# EAGLE design PCB_MAIN (EAGLE 9.1.2)

## Sheet 1 of 2
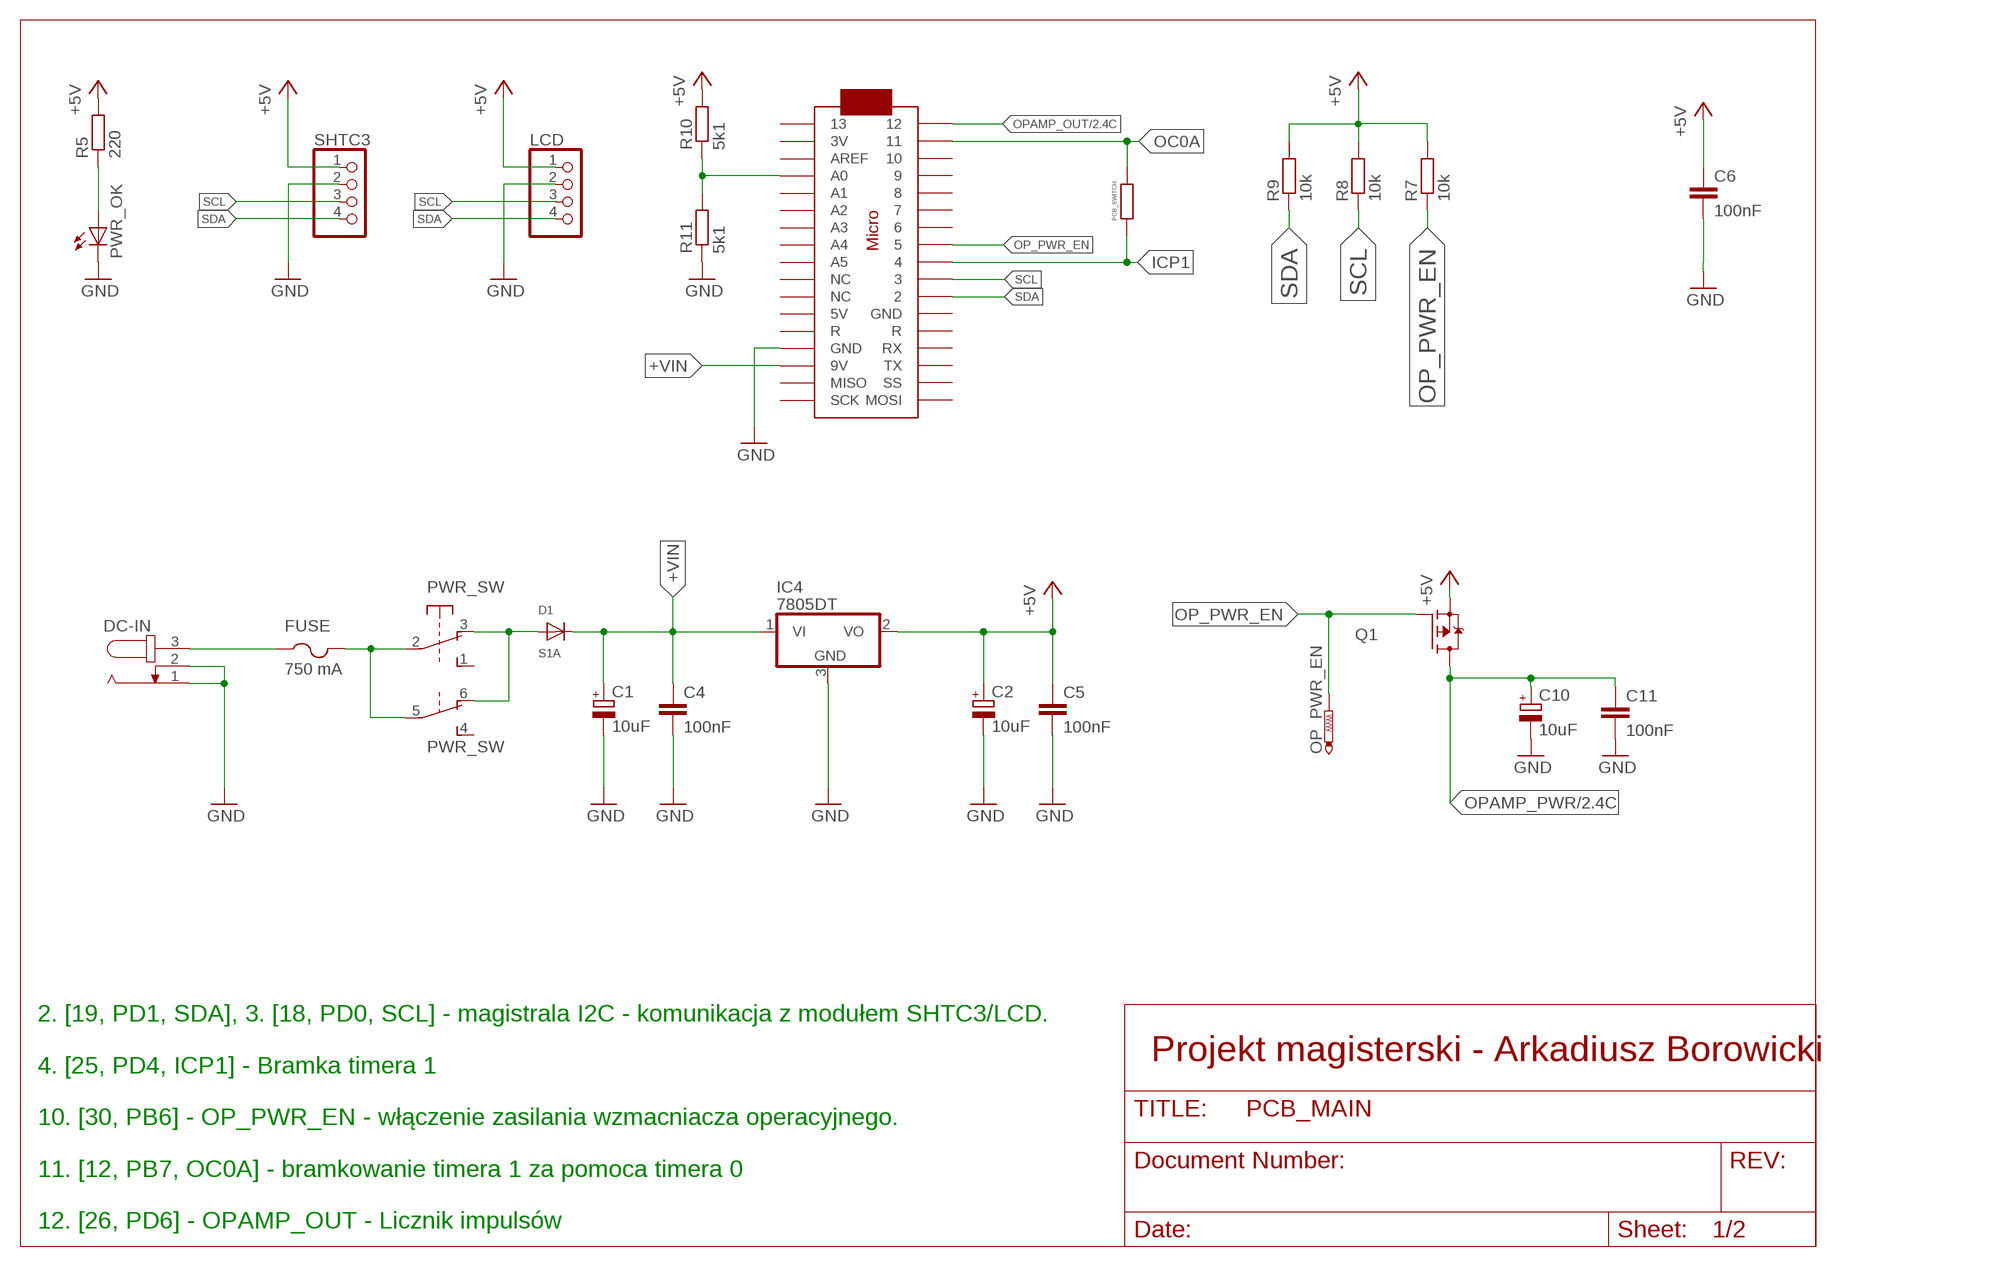
[diagram p0: schematic, sheet 1]

### Parts
C1  10uF  CPOL-EU153CLV-0605  [153CLV-0605]
C2  10uF  CPOL-EU153CLV-0605  [153CLV-0605]
C4  100nF  C-EUC1206K  [C1206K]
C5  100nF  C-EUC1206K  [C1206K]
C6  100nF  C-EUC1206K  [C1206K]
C10  10uF  CPOL-EU153CLV-0605  [153CLV-0605]
C11  100nF  C-EUC1206K  [C1206K]
D1  S1A  DIODESMA  [SMADIODE]
DC-IN  JACK-PLUG1  [SPC4078]
FUSE  750 mA  PTCFUSE-1812  [1812]
IC4  7805DT  [TO252]
LCD  PINHD-1X4  [1X04]
OP_PWR_EN  PTR1TP20R  [TP20R]
PCB_SWITCH  R-EU_R0402  [R0402]
PWR_OK  LEDSMT1206  [1206]
PWR_SW  9077-2  [9077-2]
Q1  SPD30P06PTO252  [TO252]
R5  220  R-EU_R1206  [R1206]
R7  10k  R-EU_R1206  [R1206]
R8  10k  R-EU_R1206  [R1206]
R9  10k  R-EU_R1206  [R1206]
R10  5k1  R-EU_R1206  [R1206]
R11  5k1  R-EU_R1206  [R1206]
SHTC3  PINHD-1X4  [1X04]
U$1  ARDUINOMICRO  [ARDUINOMICRO]

### Nets
+5V: C2.+ C5.1 C6.1 IC4.2(VO) LCD.1 Q1.2(S) R5.2 R7.2 R8.2 R9.2 R10.2 SHTC3.1 ; also sheet 2
+VIN: C1.+ C4.1 D1.C IC4.1(VI) U$1.P$20(9V)
GND: C1.- C2.- C4.2 C5.2 C6.2 C10.- C11.2 DC-IN.1 DC-IN.2 IC4.3(GND) LCD.2 PWR_OK.C R11.1 SHTC3.2 U$1.P$12(GND) ; also sheet 2
ICP1: PCB_SWITCH.1 U$1.P$9
N$3: R10.1 R11.2 U$1.P$31(A0)
N$4: DC-IN.3 FUSE.1
N$5: PWR_OK.A R5.1
N$6: D1.A PWR_SW.3(1:O) PWR_SW.6(2:O)
N$8: FUSE.2 PWR_SW.2(1:P) PWR_SW.5(2:P)
OC0A: PCB_SWITCH.2 U$1.P$2
OP_PWR_EN: OP_PWR_EN.TP Q1.1(G) R7.1 U$1.P$8
OPAMP_OUT: U$1.P$1 ; also sheet 2
OPAMP_PWR: C10.+ C11.1 Q1.3(D) ; also sheet 2
SCL: LCD.3 R8.1 SHTC3.3 U$1.P$10
SDA: LCD.4 R9.1 SHTC3.4 U$1.P$11
Unconnected: PWR_SW.1(1:S) PWR_SW.4(2:S) U$1.P$3 U$1.P$4 U$1.P$5 U$1.P$6 U$1.P$7 U$1.P$13(R) U$1.P$14(RX) U$1.P$15(TX) U$1.P$16(SS) U$1.P$17(MOSI) U$1.P$18(SCK) U$1.P$19(MISO) U$1.P$21(GND) U$1.P$22(R) U$1.P$23(5V) U$1.P$24(NC) U$1.P$25(NC) U$1.P$26(A5) U$1.P$27(A4) U$1.P$28(A3) U$1.P$29(A2) U$1.P$30(A1) U$1.P$32(AREF) U$1.P$33(3V) U$1.P$34

### Notes on the sheet
- Projekt magisterski - Arkadiusz Borowicki
- 2. [19, PD1, SDA], 3. [18, PD0, SCL] - magistrala I2C - komunikacja z modułem SHTC3/LCD.
  
  4. [25, PD4, ICP1] - Bramka timera 1
  
  10. [30, PB6] - OP_PWR_EN - włączenie zasilania wzmacniacza operacyjnego.
  
  11. [12, PB7, OC0A] - bramkowanie timera 1 za pomoca timera 0
  
  12. [26, PD6] - OPAMP_OUT - Licznik impulsów

## Sheet 2 of 2
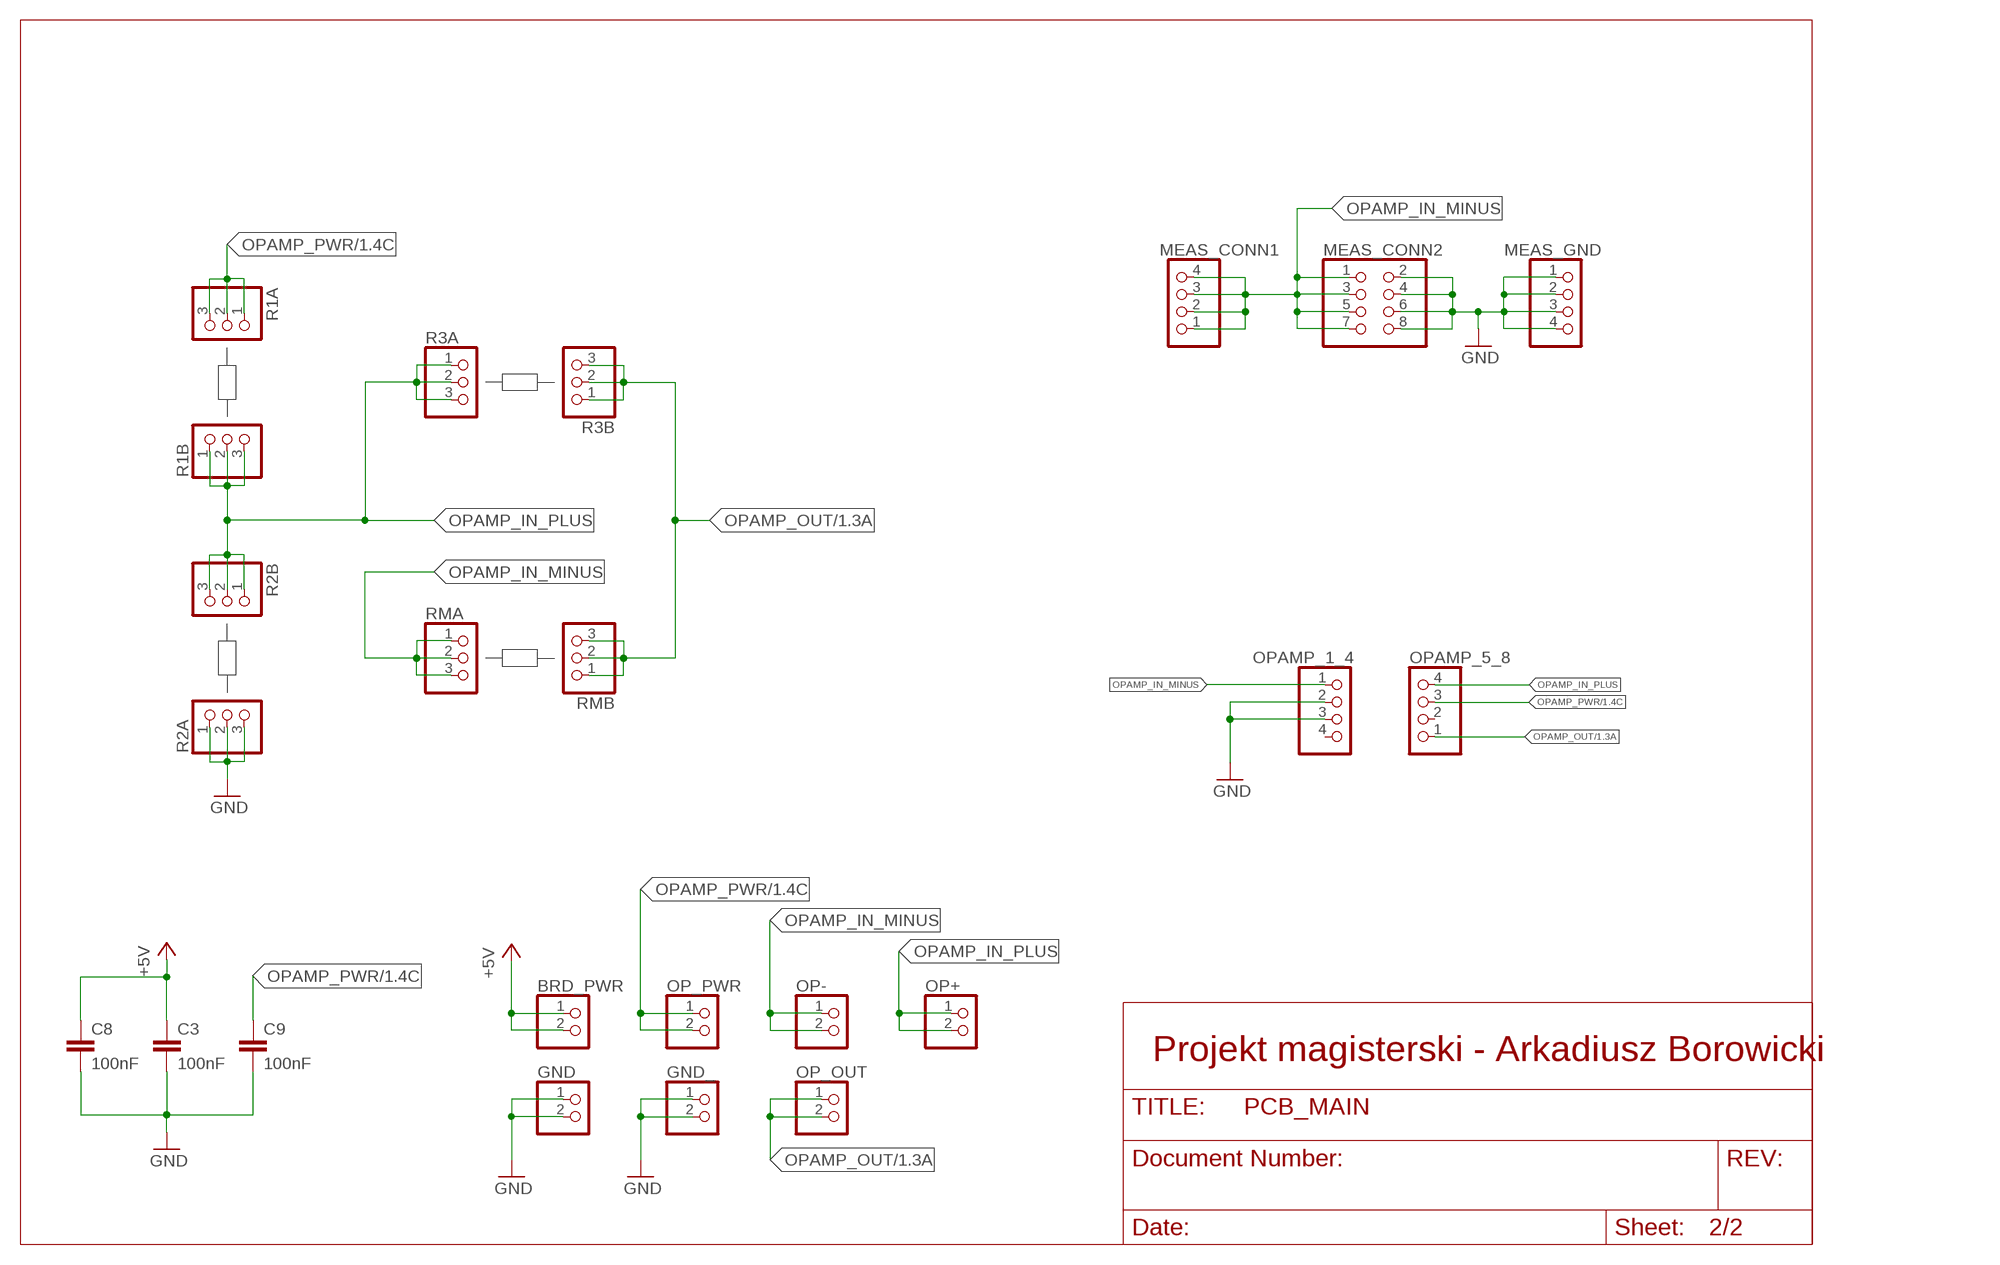
[diagram p1: schematic, sheet 2]

### Parts
BRD_PWR  PINHD-1X2  [1X02]
C3  100nF  C-EUC1206K  [C1206K]
C8  100nF  C-EUC1206K  [C1206K]
C9  100nF  C-EUC1206K  [C1206K]
GND  PINHD-1X2  [1X02]
GND_  PINHD-1X2  [1X02]
MEAS_CONN1  PINHD-1X4  [1X04]
MEAS_CONN2  PINHD-2X4  [2X04]
MEAS_GND  PINHD-1X4  [1X04]
OP+  PINHD-1X2  [1X02]
OP-  PINHD-1X2  [1X02]
OP_OUT  PINHD-1X2  [1X02]
OP_PWR  PINHD-1X2  [1X02]
OPAMP_1_4  PINHD-1X4  [1X04]
OPAMP_5_8  PINHD-1X4  [1X04]
R1A  PINHD-1X3  [1X03]
R1B  PINHD-1X3  [1X03]
R2A  PINHD-1X3  [1X03]
R2B  PINHD-1X3  [1X03]
R3A  PINHD-1X3  [1X03]
R3B  PINHD-1X3  [1X03]
RMA  PINHD-1X3  [1X03]
RMB  PINHD-1X3  [1X03]

### Nets
+5V: BRD_PWR.1 BRD_PWR.2 C3.1 C8.1 ; also sheet 1
GND: C3.2 C8.2 C9.2 GND.1 GND.2 GND_.1 GND_.2 MEAS_CONN2.2 MEAS_CONN2.4 MEAS_CONN2.6 MEAS_CONN2.8 MEAS_GND.1 MEAS_GND.2 MEAS_GND.3 MEAS_GND.4 OPAMP_1_4.2 OPAMP_1_4.3 R2A.1 R2A.2 R2A.3 ; also sheet 1
OPAMP_IN_MINUS: MEAS_CONN1.1 MEAS_CONN1.2 MEAS_CONN1.3 MEAS_CONN1.4 MEAS_CONN2.1 MEAS_CONN2.3 MEAS_CONN2.5 MEAS_CONN2.7 OP-.1 OP-.2 OPAMP_1_4.1 RMA.1 RMA.2 RMA.3
OPAMP_IN_PLUS: OP+.1 OP+.2 OPAMP_5_8.4 R1B.1 R1B.2 R1B.3 R2B.1 R2B.2 R2B.3 R3A.1 R3A.2 R3A.3
OPAMP_OUT: OP_OUT.1 OP_OUT.2 OPAMP_5_8.1 R3B.1 R3B.2 R3B.3 RMB.1 RMB.2 RMB.3 ; also sheet 1
OPAMP_PWR: C9.1 OP_PWR.1 OP_PWR.2 OPAMP_5_8.3 R1A.1 R1A.2 R1A.3 ; also sheet 1
Unconnected: OPAMP_1_4.4 OPAMP_5_8.2

### Notes on the sheet
- Projekt magisterski - Arkadiusz Borowicki

## Library data of the parts
BRD_PWR GND GND_ OP+ OP- OP_OUT OP_PWR = pinhead:PINHD-1X2: PIN HEADER
C1 C2 C10 = resistor:CPOL-EU: POLARIZED CAPACITOR, European symbol
C3-C6 C8 C9 C11 = resistor:C-EU: CAPACITOR, European symbol
D1 = adafruit:DIODE: Diode SMADIODE - SMA Surface Mount Package 20V 1A Schottky Diode Digikey: 641-1014-6-ND DO-1N4148 - Through Hole Small Current Diode SOD-123 20V 1 A (.5mV Vf) Schottky Diode - Digikey: MBRX120TPMSCT-ND SOD-323 10V 570mA (.38mV Vf, 3ns) Schottky Diode - Digikey: ZLLS410CT-ND SOD-523 30V 30mA Schottky Diode (RB751S-40TE61) - Digikey: RB751S-40TE61CT-ND SOT23-R/W - SOT23 Package (R = Solder Paste/Reflow Ovens, W = Hand-Soldering) BAT54Film 40V 300mA - Digikey: 497-7162-1-ND
DC-IN = con-jack:JACK-PLUG: DC POWER JACK Power Jack, DC, Right Angle, Through Hole, Rated 5A at 16VDC, PC Terminals Distributor: Farnell (www.Farnell.de) Drawing: 84N1161.pdf / 84N1162.pdf Manufacturer: SPC Technology (www.spctechnology.com) Type: SPC4077 / SPC 4078; OC_FARNELL: unknown; OC_NEWARK: unknown
FUSE = adafruit:PTCFUSE: PTC fuses, resettable thermistors
IC4 = adafruit:78*: Positive VOLTAGE REGULATOR Added bigger pads to the TO-92 package
LCD MEAS_CONN1 MEAS_GND OPAMP_1_4 OPAMP_5_8 SHTC3 = pinhead:PINHD-1X4: PIN HEADER
MEAS_CONN2 = pinhead:PINHD-2X4: PIN HEADER
OP_PWR_EN = testpad:PTR1: TEST PIN
PCB_SWITCH R5 R7-R11 = resistor:R-EU_: RESISTOR, European symbol
PWR_OK = adafruit:LED: LED OSRAM: - CHIPLED LG R971, LG N971, LY N971, LG Q971, LY Q971, LO R971, LY R971 LH N974, LH R974 LS Q976, LO Q976, LY Q976 LO Q996 - Hyper CHIPLED LW Q18S LB Q993, LB Q99A, LB R99A - SideLED LS A670, LO A670, LY A670, LG A670, LP A670 LB A673, LV A673, LT A673, LW A673 LH A674 LY A675 LS A676, LA A676, LO A676, LY A676, LW A676 LS A679, LY A679, LG A679 - Hyper Micro SIDELED® LS Y876, LA Y876, LO Y876, LY Y876 LT Y87S - SmartLED LW L88C, LW L88S LB L89C, LB L89S, LG L890 LS L89K, LO L89K, LY L89K LS L896, LA L896, LO L896, LY L896 - TOPLED LS T670, LO T670, LY T670, LG T670, LP T670 LSG T670, LSP T670, LSY T670, LOP T670, LYG T670 LG T671, LOG T671, LSG T671 LB T673, LV T673, LT T673, LW T673 LH T674 LS T676, LA T676, LO T676, LY T676, LB T676, LH T676, LSB T676, LW T676 LB T67C, LV T67C, LT T67C, LS T67K, LO T67K, LY T67K, LW E67C LS E67B, LA E67B, LO E67B, LY E67B, LB E67C, LV E67C, LT E67C LW T67C LS T679, LY T679, LG T679 LS T770, LO T770, LY T770, LG T770, LP T770 LB T773, LV T773, LT T773, LW T773 LH T774 LS E675, LA E675, LY E675, LS T675 LS T776, LA T776, LO T776, LY T776, LB T776 LHGB T686 LT T68C, LB T68C - Hyper Mini TOPLED® LB M676 - Mini TOPLED Santana® LG M470 LS M47K, LO M47K, LY M47K Source: http://www.osram.convergy.de/
PWR_SW = switch-misc:9077-2: MARQUARDT SWITCH 9077.0200 Distributor: Buerklin <https://www.buerklin.com/default.asp?event=ShowArtikel%2812G2822%29&l=d&jump=ArtNr_12G2822>
Q1 = transistor-fet:SPD30P06P: SIPMOS(R) Power-Transistor P-Channel, Enhancement mode Source: http://www.infineon.com/upload/Document/cmc_upload/documents/012/3615/SPD_U30P06P.pdf
R1A R1B R2A R2B R3A R3B RMA RMB = pinhead:PINHD-1X3: PIN HEADER
U$1 = adafruit:ARDUINOMICRO

## Board
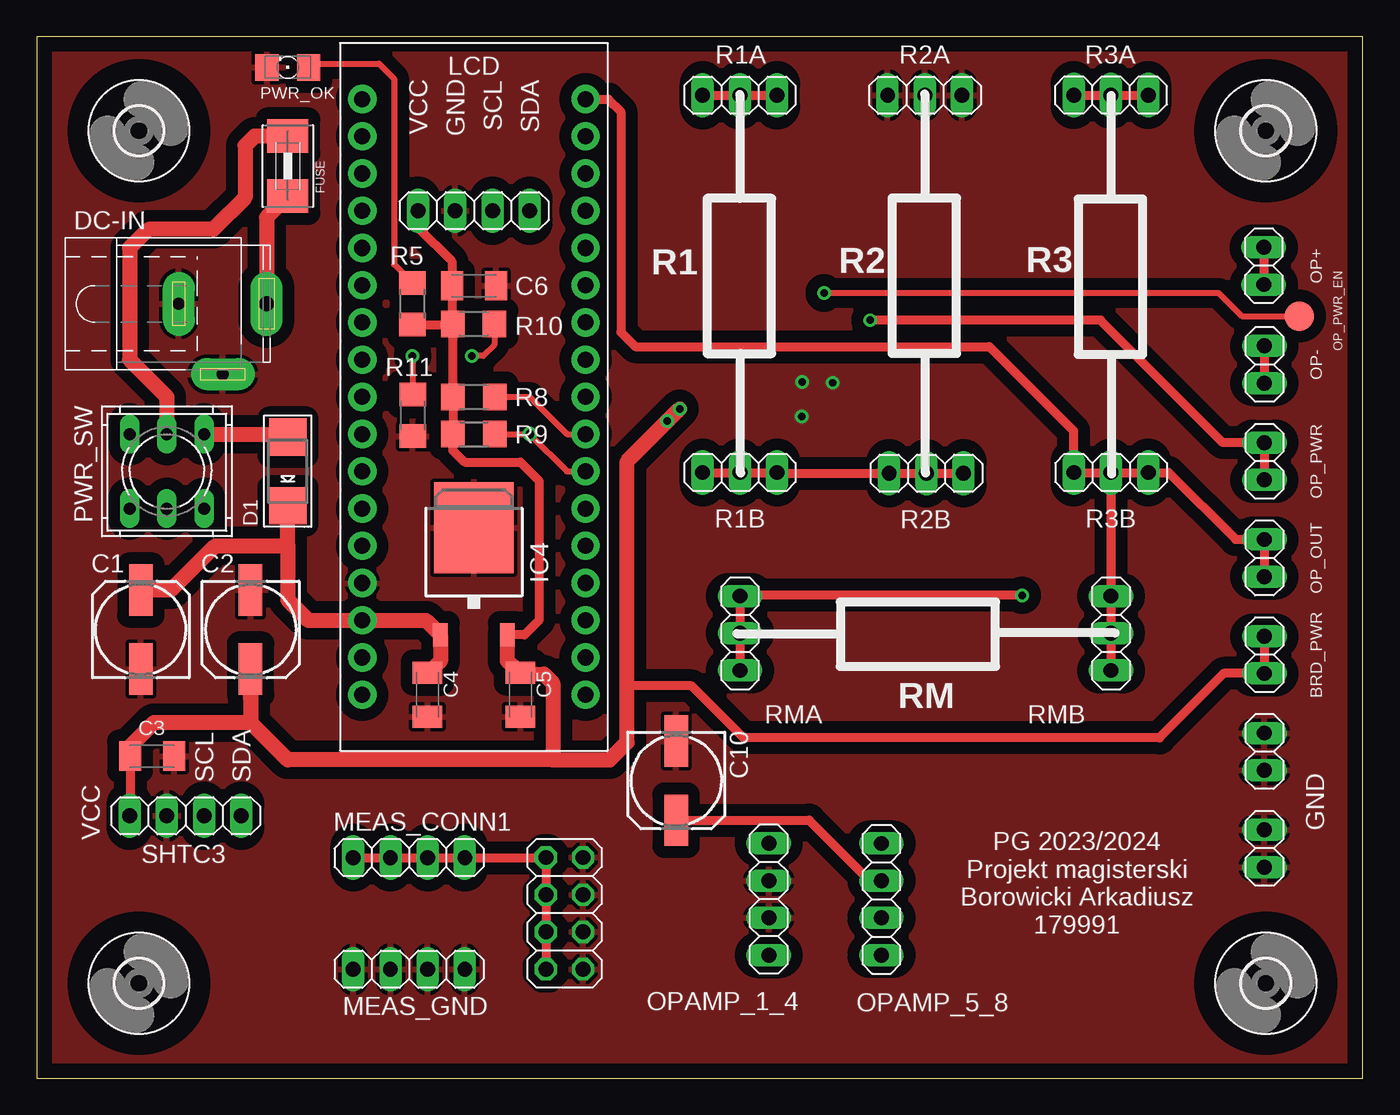
[diagram p2: board, top side]
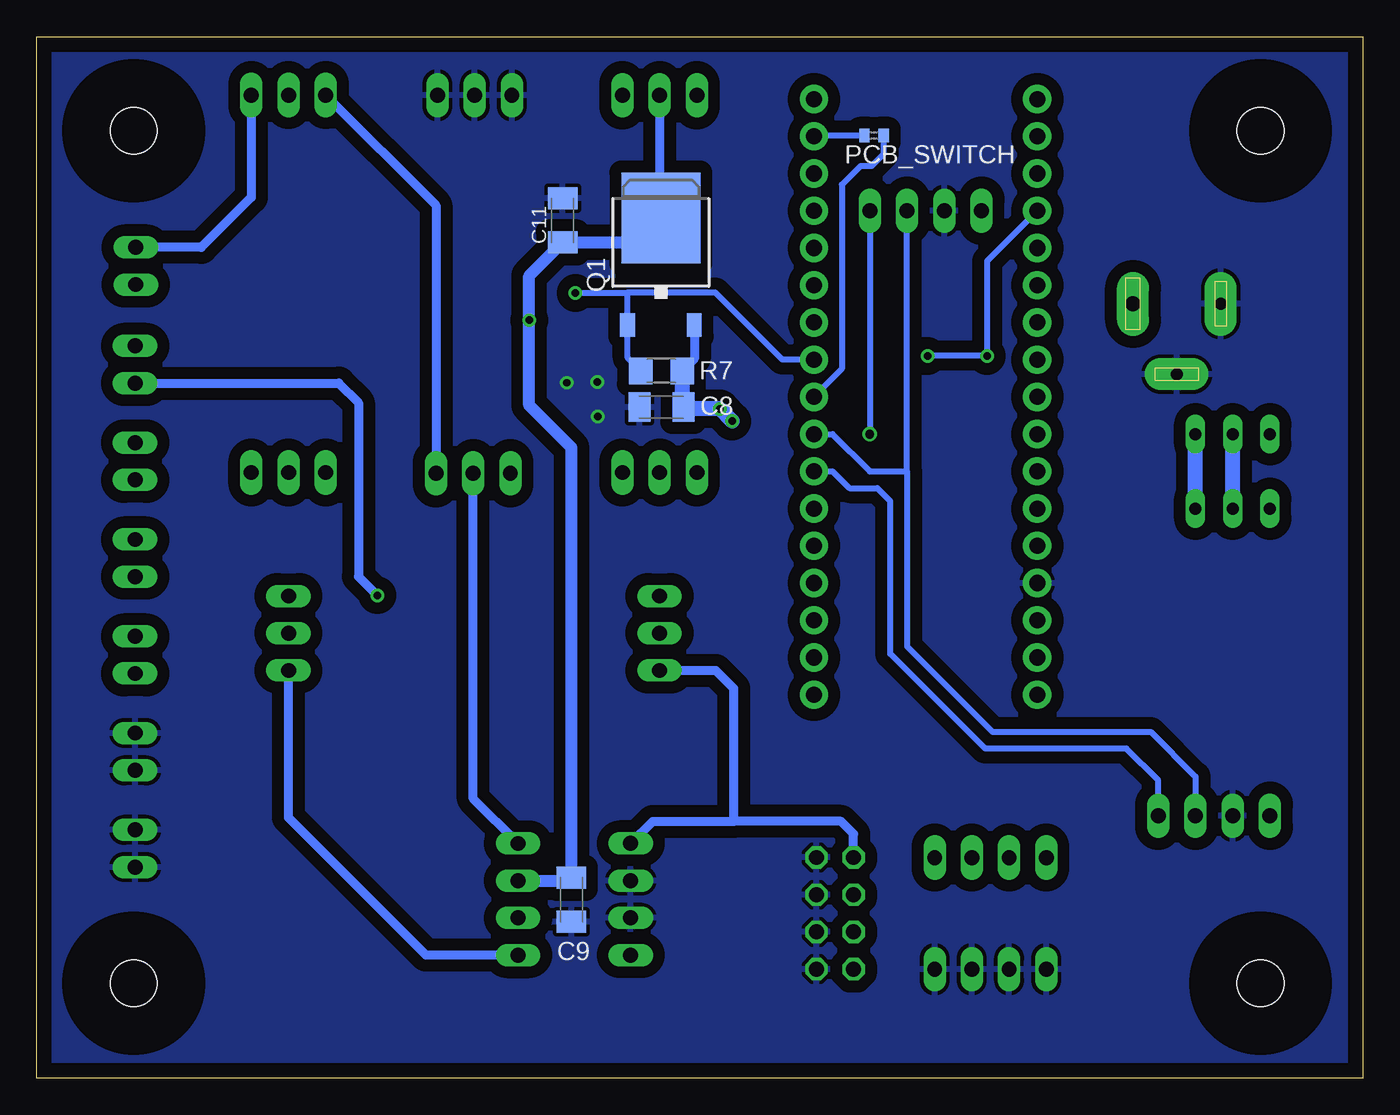
[diagram p3: board, bottom side, seen from below]

Size 90.52 x 71.06 mm. Coordinates in mm from the lower left corner, seen from the top.
Outline: 0,0 90.52,0 90.52,71.06 0,71.06 0,0
Copper layers (1*16): Top 0.035mm / dielectric 1.5mm / Bottom 0.035mm
Design rules "default *": minimum track width 10mil, minimum drill 20mil, track to track 8mil, track to pad 8mil, pad to pad 8mil, via to via 8mil, smd to smd 8mil, copper to edge 40mil, drill to drill 8mil, minimum pad ring 10mil, minimum via ring 8mil, stop-mask expansion 4mil, vias tented up to drill 25mil, thermal gap 10mil

### Footprints (pad centres in the part's own frame; a part is rotated, then mirrored left to right if it is on the bottom)
1X02 = drill 1.016 long: 1 -1.27,0; 2 1.27,0
153CLV-0605 = smd 3.5 x 1.6: + 2.7,0; - -2.7,0
C1206K = smd 1.5 x 2: 1 -1.5,0; 2 1.5,0
SMADIODE = smd 2.54 x 2.54: A 2.349,0; C -2.349,0
SPC4078 = drill 0.8 pad 2.184 long: 1 -3,0; 2 0,-4.8 | drill 1 pad 2.184 long: 3 3,0
1812 = smd 2.286 x 2.794: 1 -2.046,0; 2 2.046,0
TO252 = smd 1 x 1.6: 1 -2.28,-4.8; 2 2.28,-4.8 | smd 5.4 x 6.2: 3 0,2.5
1X04 = drill 1.016 long: 1 -3.81,0; 2 -1.27,0; 3 1.27,0; 4 3.81,0
2X04 = drill 1.016 octagon: 1 -3.81,-1.27; 2 -3.81,1.27; 3 -1.27,-1.27; 4 -1.27,1.27; 5 1.27,-1.27; 6 1.27,1.27; 7 3.81,-1.27; 8 3.81,1.27
TP20R = smd 2 x 2: TP 0,0
R0402 = smd 0.7 x 0.9: 1 -0.65,0; 2 0.65,0
1206 = smd 1.6 x 1.803: A -1.422,0; C 1.422,0
9077-2 = drill 0.813 long: 1 -2.54,2.54; 2 0,2.54; 3 2.54,2.54; 4 -2.54,-2.54; 5 0,-2.54; 6 2.54,-2.54
1X03 = drill 1.016 long: 1 -2.54,0; 2 0,0; 3 2.54,0
R1206 = smd 1.6 x 1.803: 1 -1.422,0; 2 1.422,0
ARDUINOMICRO = drill 1.1 pad 1.93: P$1 -20.32,7.62; P$2 -17.78,7.62; P$3 -15.24,7.62; P$4 -12.7,7.62; P$5 -10.16,7.62; P$6 -7.62,7.62; P$7 -5.08,7.62; P$8 -2.54,7.62; P$9 0,7.62; P$10 2.54,7.62; P$11 5.08,7.62; P$12 12.7,-7.62; P$13 10.16,-7.62; P$14 12.7,7.62; P$15 15.24,7.62; P$16 17.78,7.62; P$17 20.32,7.62; P$18 20.32,-7.62; P$19 17.78,-7.62; P$20 15.24,-7.62; P$21 7.62,7.62; P$22 10.16,7.62; P$23 7.62,-7.62; P$24 5.08,-7.62; P$25 2.54,-7.62; P$26 0,-7.62; P$27 -2.54,-7.62; P$28 -5.08,-7.62; P$29 -7.62,-7.62; P$30 -10.16,-7.62; P$31 -12.7,-7.62; P$32 -15.24,-7.62; P$33 -17.78,-7.62; P$34 -20.32,-7.62
3,2 = hole 3.2: 0,0

### Placement (x,y rotation side)
BRD_PWR  83.8,28.88 270 top
C1  7.11,30.61 90 top
C2  14.61,30.61 270 top
C3  7.87,21.97 0 top
C4  26.67,26.16 270 top
C5  33.02,26.16 270 top
C6  29.84,54.07 0 top
C8  47.88,45.78 180 bottom
C9  54.03,12.17 270 bottom
C10  43.65,20.3 270 top
C11  54.62,58.52 90 bottom
D1  17.14,41.4 90 top
DC-IN  12.7,52.83 0 top
FUSE  17.14,62.23 90 top
GND  83.8,15.67 270 top
GND_  83.8,22.28 270 top
IC4  29.84,35.05 0 top
LCD  29.84,59.18 0 top
MEAS_CONN1  25.42,15.05 0 top
MEAS_CONN2  36.03,11.25 270 top
MEAS_GND  25.42,7.43 0 top
OP+  83.75,55.42 270 top
OP-  83.8,48.69 270 top
OP_OUT  83.8,35.48 270 top
OP_PWR  83.8,42.09 270 top
OP_PWR_EN  86.2,51.99 0 top
OPAMP_1_4  49.97,12.21 270 top
OPAMP_5_8  57.67,12.2 90 top
PCB_SWITCH  33.36,64.32 180 bottom
PWR_OK  17.14,68.96 180 top
PWR_SW  8.89,41.4 0 top
Q1  47.91,56.19 0 bottom
R1A  48,67.06 0 top
R1B  48,41.32 0 top
R2A  60.63,67.06 0 top
R2B  60.73,41.27 0 top
R3A  73.33,67.08 180 top
R3B  73.33,41.32 0 top
R5  25.65,52.83 270 top
R7  47.88,48.26 0 bottom
R8  29.84,46.48 180 top
R9  29.84,43.94 180 top
R10  29.83,51.47 180 top
R11  25.67,45.23 90 top
RMA  48.01,30.36 90 top
RMB  73.33,30.36 90 top
SHTC3  10.16,17.91 0 top
U$1  29.84,46.48 270 top
U$2  [3,2]  6.99,6.48 0 top
U$3  [3,2]  6.99,64.64 0 top
U$4  [3,2]  83.9,6.48 0 top
U$5  [3,2]  83.9,64.64 0 top

### Tracks (layer width: path | path; a pad name or v marks a point on that pad's centre or on a via)
+5V  (via drill 0.51)
  Top 0.61: IC4.2 33.3,30.25 34.29,31.24 34.29,40.77 33.02,42.04 29.21,42.04 28.42,42.82 R9.2 R8.2 28.41,46.5 R10.2 | 14.48,26.04 14.61,25.91 | 28.42,54.05 C6.1 | SHTC3.1 6.37,17.93 C3.1 6.35,22 6.35,22.61 | LCD.1 26.04,58.04 28.34,55.73 C6.1 | R10.2 28.41,54.01 C6.1 | R5.2 28.35,51.41 R10.2 | BRD_PWR.1 BRD_PWR.2 81.03,27.61 76.63,23.22 48.26,23.22 44.7,26.77 40.44,26.77 40.31,26.64
  Top 1.016: IC4.2 32.12,28.46 C5.1 34.63,27.56 35.24,26.95 35.24,21.72 | 14.61,25.91 C2.+ 14.61,24.26 | 35.24,21.72 17.14,21.72 14.61,24.26 | 14.61,24.26 8,24.26 6.35,22.61 | 35.24,21.72 35.5,21.72 | 35.24,21.72 39.12,21.72 40.31,22.91 40.31,26.64 40.31,42.09 v43.89,45.67
  Bottom 0.61: Q1.2 45.63,49.09 R7.2
  Bottom 1.016: 46.46,48.23 R7.2 46.46,45.86 C8.1 46.27,45.67 v43.89,45.67 v43.05,44.83
+VIN
  Top 1.016: C4.1 27.57,28.46 IC4.1 26.57,31.24 U$1.P$20 18.54,31.24 17.14,32.64 17.14,36.32 | 17.14,36.32 D1.C | C1.+ 9.18,33.31 12.19,36.32 17.14,36.32
GND  (via drill 0.51)
  Top 0.61: 31.24,54.07 C6.2
  Top 1.016: 7.14,27.3 C1.-
  other vias: 52.25,47.5 54.33,47.45 52.22,45.14
  pour Bottom (isolate 0.813): 0,71.25 90.93,71.25 90.93,-0.25 0,-0.14
  pour Top (isolate 0.813): 0,71.25 90.93,71.25 90.93,-0.25 0,-0.14
ICP1
  Bottom 0.406: PCB_SWITCH.1 32.71,63.04 33.53,62.23 34.29,62.23 35.56,60.96 35.56,48.39 U$1.P$9
N$3  (via drill 0.51)
  Top 0.406: 31.22,51.5 R10.1 31.25,50.05 30.48,49.28 v29.72,49.28 | v25.65,49.28 25.65,46.66 R11.2
  Bottom 0.406: U$1.P$31 25.65,55.75 25.65,53.59 v25.65,49.28 v29.72,49.28
N$4
  Top 1.016: FUSE.1 15.7,58.74 DC-IN.3
N$5
  Top 0.406: PWR_OK.A 18.41,69.22 23.37,69.22 24.38,68.2 24.38,55.52 R5.1
N$6
  Top 1.016: PWR_SW.3 16.95,43.94 D1.A
  Bottom 1.016: PWR_SW.6 PWR_SW.3
N$8
  Top 1.016: PWR_SW.2 8.89,46.48 6.35,49.02 6.35,56.64 7.62,57.91 12.06,57.91 14.22,60.07 14.22,63.63 14.87,64.28 FUSE.2
  Bottom 1.016: PWR_SW.5 PWR_SW.2
OC0A
  Bottom 0.406: PCB_SWITCH.2 37.41,64.32 U$1.P$2
OP_PWR_EN  (via drill 0.51)
  Top 0.406: v53.75,53.57 53.82,53.57 80.69,53.57 82.26,51.99 OP_PWR_EN.TP
  Bottom 0.406: U$1.P$8 39.62,49.02 42.16,51.56 44.2,53.59 50.22,53.59 50.19,53.57 | R7.1 50.19,49.15 Q1.1 50.19,53.57 | 50.19,53.57 v53.75,53.57
OPAMP_IN_MINUS  (via drill 0.51)
  Top 0.61: RMA.1 RMA.2 RMA.3 48.05,32.94 v67.26,32.94 | OP-.1 OP-.2 | MEAS_CONN1.1 MEAS_CONN1.2 MEAS_CONN1.3 MEAS_CONN1.4 MEAS_CONN2.1 MEAS_CONN2.3 MEAS_CONN2.5 MEAS_CONN2.7
  Bottom 0.61: MEAS_CONN2.1 34.76,16.67 35.61,17.53 42.95,17.53 | 42.95,17.53 42.95,26.6 44.17,27.82 RMA.1 | 83.75,47.37 OP-.2 69.9,47.42 68.56,46.08 68.56,34.21 67.28,32.94 v67.26,32.94 | OPAMP_1_4.1 48.46,17.53 42.95,17.53
OPAMP_IN_PLUS
  Top 0.61: R1B.1 R1B.2 R1B.3 50.59,41.27 R2B.1 R2B.2 R2B.3 | R3A.3 R3A.2 R3A.1 | OP+.1 OP+.2
  Bottom 0.61: R3A.1 75.87,60.09 79.28,56.69 OP+.1 | 58.14,41.22 R2B.1 | R3A.3 63.27,59.55 R2B.3 | OPAMP_5_8.4 60.73,19.07 R2B.2
OPAMP_OUT
  Top 0.61: R3B.2 R3B.1 70.76,41.35 70.76,44.17 65.02,49.91 40.87,49.91 39.88,50.9 39.88,65.94 39.01,66.8 U$1.P$1 | R3B.2 R3B.3 77.27,41.32 81.84,36.75 OP_OUT.1 OP_OUT.2 | RMB.2 RMB.3 R3B.2 | RMB.2 RMB.1 | RMB.2
  Bottom 0.61: OPAMP_5_8.1 63.94,8.39 73.33,17.78 RMB.1
OPAMP_PWR  (via drill 0.51)
  Top 0.61: R1A.1 R1A.2 R1A.3 | OP_PWR.2 OP_PWR.1 80.97,43.36 72.62,51.71 v56.9,51.71 | OPAMP_5_8.3 56.86,13.47 52.73,17.6 C10.+
  Bottom 0.61: R1A.2 48,60.17 | 48,60.17 48,58.78 Q1.3 | 48.15,60.02 48,60.17
  Bottom 0.813: 48,58.78 48,57.73 47.88,57.61 48.46,57.02 C11.1 56.9,54.74 v56.9,51.71 56.9,45.9 54.03,43.03 C9.1 54.22,13.47 OPAMP_5_8.3
SCL
  Top 0.406: R8.1 33.66,46.48 36.2,43.94 U$1.P$10
  Bottom 0.406: SHTC3.3 11.43,20.57 14.48,23.62 25.27,23.62 31.11,29.46 31.11,41.4 | U$1.P$10 36.2,43.94 33.66,41.4 31.11,41.4 | 31.11,41.4 LCD.3
SDA  (via drill 0.6)
  Top 0.406: R9.1 v33.66,43.94 36.2,41.4 U$1.P$11
  Bottom 0.406: U$1.P$11 36.2,41.4 35.05,40.26 33.15,40.26 32.26,39.37 32.26,28.96 25.78,22.48 16.13,22.48 13.97,20.32 SHTC3.4 | LCD.4 v33.66,43.94

### Text on the board
tNames: SCL | SDA | VCC | GND | R1 | R2 | R3 | RM | SCL | SDA | VCC | PG 2023/2024 / Projekt magisterski / Borowicki Arkadiusz / 179991